# Altium schematic sheet High-Efficiency 3.3V DC-DC Converter for STM32.SchDoc
size A2
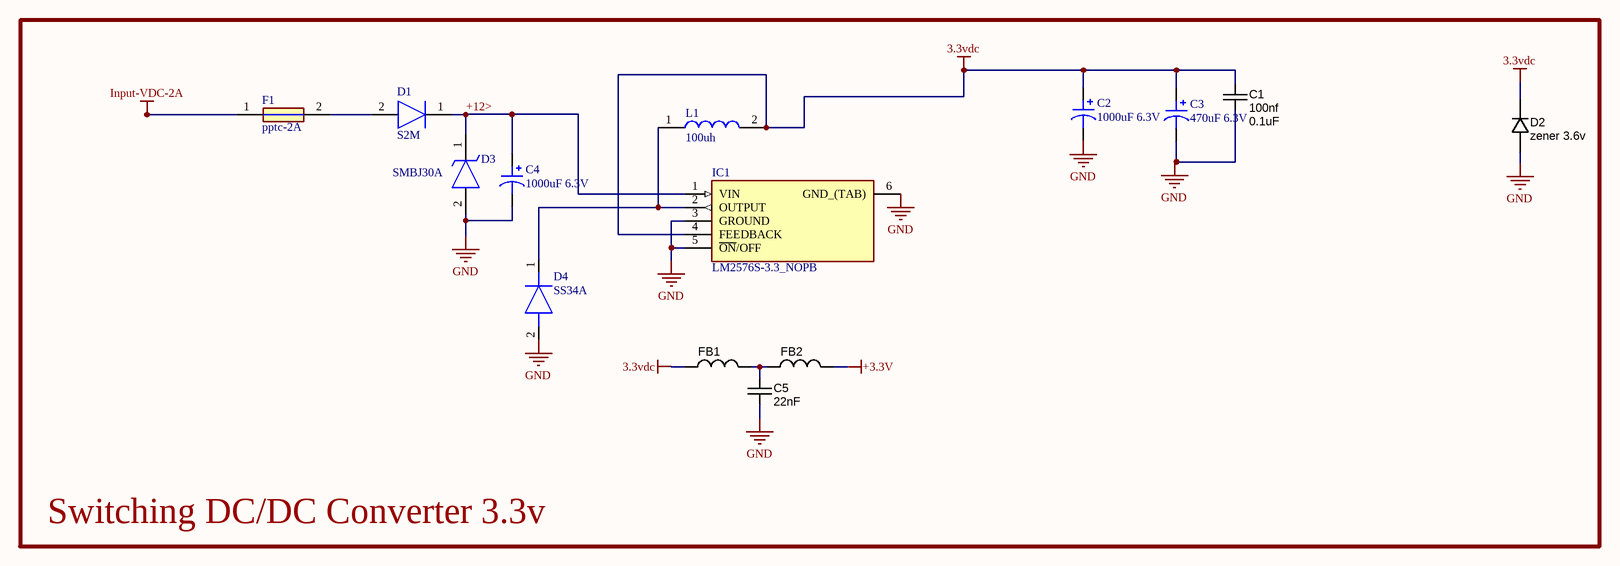
[diagram p0: High-Efficiency 3.3V DC-DC Converter for STM32.SchDoc]

## Parts
C1  100nf  value 0.1uF  [CAPC3316X185N]
C2  1000uF 6.3V  [CAP ALSMD POLY 8.3MM H9.0MM]
C3  470uF 6.3V  [CAP ALSMD POLY 6.3MM H5.8MM]
C4  1000uF 6.3V  [CAP ALSMD POLY 8.3MM H9.0MM]
C5  value 22nF  [CAPC3216X180N]  (hidden comment: 22nf_0805)
D1  S2M  [DIOM5336X265N]
D2  Manufacturer Part Number 1: zener 3.6v  [SOD80, LL-34]  (hidden comment: Mini MELF)
D3  SMBJ30A  [DIOM5436X261N]
D4  SS34A  [DIOM5026X262N]
F1  pptc-2A  [FUSC3216X75N]
FB1  fb_1K@100MHZ_0805  [FUSC3216X75N]  (value not drawn)
FB2  fb_1K@100MHZ_0805  [FUSC3216X75N]  (value not drawn)
IC1  LM2576S-3.3_NOPB  [TO170P1435X465-6N]
L1  100uh  [CD75NP221KC]

## Blocks framed on the sheet
Switching DC/DC Converter 3.3v: C1-C5 D1-D4 F1 FB1 FB2 IC1 L1

## Nets
3.3vdc: C1.1 C2.1 C3.1 D2.K FB1.1 IC1.4(FEEDBACK) L1.2
+3.3V: FB2.2
GND: C1.2 C2.2 C3.2 C4.2 C5.2 D2.A D3.2(A) D4.2(A) IC1.3(GROUND) IC1.5(~{ON}/OFF) IC1.6(GND_(TAB))
Input-VDC-2A: F1.1
+12>: C4.1 D1.1(K) D3.1(K) IC1.1(VIN)
NetC5_1: C5.1 FB1.2 FB2.1
NetD1_2: D1.2(A) F1.2
NetD4_1: D4.1(K) IC1.2(OUTPUT) L1.1

## Library data of the parts
C1 = CAPC_1n8_50V_0805: Capacitor SMD Cer 100n 10% 50V X7R 0805; Manufacturer 1: AVX Corporation; Manufacturer Part Number 1: 08055C182KAT2A; Ratings: 50V; X7R; SCDType: source*; Tolerance: ±10%; Operating Temperature: -55°C ~ 125°C; Package / Case: 0805 (2012 metric); Supplier 1: Digi-Key; Supplier Part Number 1: 478-1374-1-ND
C2 C4 = Cap Alu SMD 8.3mm H9.0mm: SMT Aluminum Polymer Capacitor; VALUE: 1000uF 6.3V
C3 = Cap Alu SMD 6.3mm H5.8mm: 470uf; VALUE: 470uF 6.3V
C5 = CAPC_1u_0805_X7R_16V_10%: Capacitor SMD Cer 1uF 10% 16V X7R 0805; Manufacturer 1: Yageo; Manufacturer Part Number 1: CC0805KKX7R7BB105; Ratings: 16V; X7R; Material: ceramic; SCDType: spec; Package / Case: 0805 (2012 metric); Tolerance: ±10%; Supplier 1: Digi-Key; Supplier Part Number 1: 311-1365-6-ND; RoHS 1: RoHS Compliant; Temperature Coefficient: X7R; ComponentLink1URL: http://www.yageo.com/documents/recent/UPY-GPHC_X7R_6.3V-to-50V_8.pdf; ComponentLink1Description: http://www.yageo.com/documents/recent/UPY-GPHC_X7R_6.3V-to-50V_8.pdf; Supplier 2: Digi-Key; Supplier Part Number 2: 399-1284-6-ND; Manufacturer 2: Kemet; Manufacturer Part Number 2: C0805C105K4RACTU; RoHS 2: RoHS Compliant; ComponentLink2URL: http://www.kemet.com/datasheets&C0805C105K4RACTU; ComponentLink2Description: http://www.kemet.com/datasheets&C0805C105K4RACTU; Supplier 3: Digi-Key; Supplier Part Number 3: 1276-1026-6-ND; Manufacturer 3: Samsung Electro-Mechanics America, Inc; Manufacturer Part Number 3: CL21B105KOFNNNE; RoHS 3: RoHS Compliant; ComponentLink3URL: http://www.samsungsem.com/servlet/FileDownload?type=spec&file=CL21B105KOFNNNE.pdf; ComponentLink3Description: http://www.samsungsem.com/servlet/FileDownload?type=spec&file=CL21B105KOFNNNE.pdf; Supplier 4: Digi-Key; Supplier Part Number 4: 445-1358-6-ND; Manufacturer 4: TDK Corporation; Manufacturer Part Number 4: C2012X7R1C105K125AA; RoHS 4: RoHS Compliant; ComponentLink4URL: http://product.tdk.com/capacitor/mlcc/en/documents/mlcc_commercial_general_en.pdf; ComponentLink4Description: http://product.tdk.com/capacitor/mlcc/en/documents/mlcc_commercial_general_en.pdf
D1 = S2M: Diode; Manufacturer_Name: ON Semiconductor; Datasheet Link: https://www.onsemi.com/pub/Collateral/S2M-D.pdf; Height: 2.65mm; Manufacturer_Part_Number: S2M; Mouser Part Number: 512-S2M; Mouser Price/Stock: https://www.mouser.co.uk/ProductDetail/ON-Semiconductor-Fairchild/S2M?qs=a0wxjULRyoFPR8XEAEgF8g%3D%3D; Arrow Part Number: S2M; Arrow Price/Stock: https://www.arrow.com/en/products/s2m/on-semiconductor
D2 = DIODE_100V_500mW_MELF: Diode SMD 3.6v 150mA 500mW SOD80; Manufacturer 1: Fairchild Semiconductor; Ratings: 3.6V; 150mA min; 500mW; Material: Si; Diode Type: Standard; SCDType: source; Package / Case: SOD80, LL-34; Value: 3.6V; Manufacturer 2: DC Components; Manufacturer Part Number 2: DL4148
D3 = SMBJ30A: Manufacturer_Name: LITTELFUSE; Datasheet Link: https://www.littelfuse.com/~/media/electronics/datasheets/tvs_diodes/littelfuse_tvs_diode_smbj_datasheet.pdf.pdf; Height: 2.61mm; Manufacturer_Part_Number: SMBJ30A; Arrow Part Number: SMBJ30A; Arrow Price/Stock: https://www.arrow.com/en/products/smbj30a/littelfuse; Mouser Part Number: 576-SMBJ30A; Mouser Price/Stock: https://www.mouser.co.uk/ProductDetail/Littelfuse/SMBJ30A?qs=JJML70Qc14vKfctaMzTTAQ%3D%3D
D4 = SS34A: Diode; Manufacturer_Name: HY Electronic; Datasheet Link: https://datasheet.datasheetarchive.com/originals/distributors/Datasheets-3/DSA-43252.pdf; Height: 2.62mm; Manufacturer_Part_Number: SS34A
F1 = 0805L050WR: pptc 500ma; Manufacturer_Name: LITTELFUSE; Datasheet Link: http://www.littelfuse.com/~/media/electronics/datasheets/resettable_ptcs/littelfuse_ptc_0805l_datasheet.pdf.pdf; Height: 1.25mm; Manufacturer_Part_Number: 0805L050WR; Mouser Part Number: 576-0805L050; Mouser Price/Stock: https://www.mouser.co.uk/ProductDetail/Littelfuse/0805L050WR?qs=SJZ%252BTX%252BI2BS1ufZ22HRodg%3D%3D; Arrow Part Number: 0805L050WR; Arrow Price/Stock: https://www.arrow.com/en/products/0805l050wr/littelfuse
FB1 FB2 = FERRITE_2K2-100MHz_0805: Manufacturer 1: Laird-Signal Integrity Products; Manufacturer Part Number 1: HZ0805B222R-10; Ratings: 200 mA; 800 mOhm DC; Impedance @ Frequency: 600 Ohm @ 100MHz; Current Rating: 200mA; DC Resistance (DCR): 800 mOhm Max; Filter Type: Differential Mode - Single; SCDType: source; Value: ferrite bead; Size / Dimension: 0.063" L x 0.031" W (1.60mm x 0.80mm); Package / Case: 0805 (2012 Metric); Height (Max): 0.043" (1.09mm); ComponentLink1URL: http://www.lairdtech.com/WorkArea/linkit.aspx?LinkIdentifier=id&ItemID=4879; ComponentLink1Description: http://www.lairdtech.com/WorkArea/linkit.aspx?LinkIdentifier=id&ItemID=4879; Supplier 1: Digi-Key; Supplier Part Number 1: 240-2562-1-ND; Mounting Type: Surface Mount
IC1 = LM2576S-3.3_NOPB: Integrated Circuit; Manufacturer_Name: Texas Instruments; Manufacturer_Part_Number: LM2576S-3.3/NOPB; Datasheet Link: http://www.ti.com/lit/ds/symlink/lm2576.pdf; Height: 4.65mm; Mouser Part Number: 926-LM2576S-3.3/NOPB; Mouser Price/Stock: https://www.mouser.co.uk/ProductDetail/Texas-Instruments/LM2576S-3.3-NOPB?qs=X1J7HmVL2ZHgUfnXFulfHg%3D%3D; Arrow Part Number: LM2576S-3.3/NOPB; Arrow Price/Stock: https://www.arrow.com/en/products/lm2576s-3.3nopb/texas-instruments?region=nac
L1 = SRN8040-101M: Manufacturer_Name: Bourns; Datasheet Link: https://www.bourns.com/pdfs/SRN8040.pdf; Height: 4mm; Manufacturer_Part_Number: SRN8040-101M; Mouser Part Number: 652-SRN8040-101M; Mouser Price/Stock: https://www.mouser.co.uk/ProductDetail/Bourns/SRN8040-101M?qs=opBjA1TV902pEUqOZBsqAg%3D%3D; Arrow Part Number: SRN8040-101M; Arrow Price/Stock: https://www.arrow.com/en/products/srn8040-101m/bourns